# EAGLE design Sensorboard (EAGLE 9.5.2)
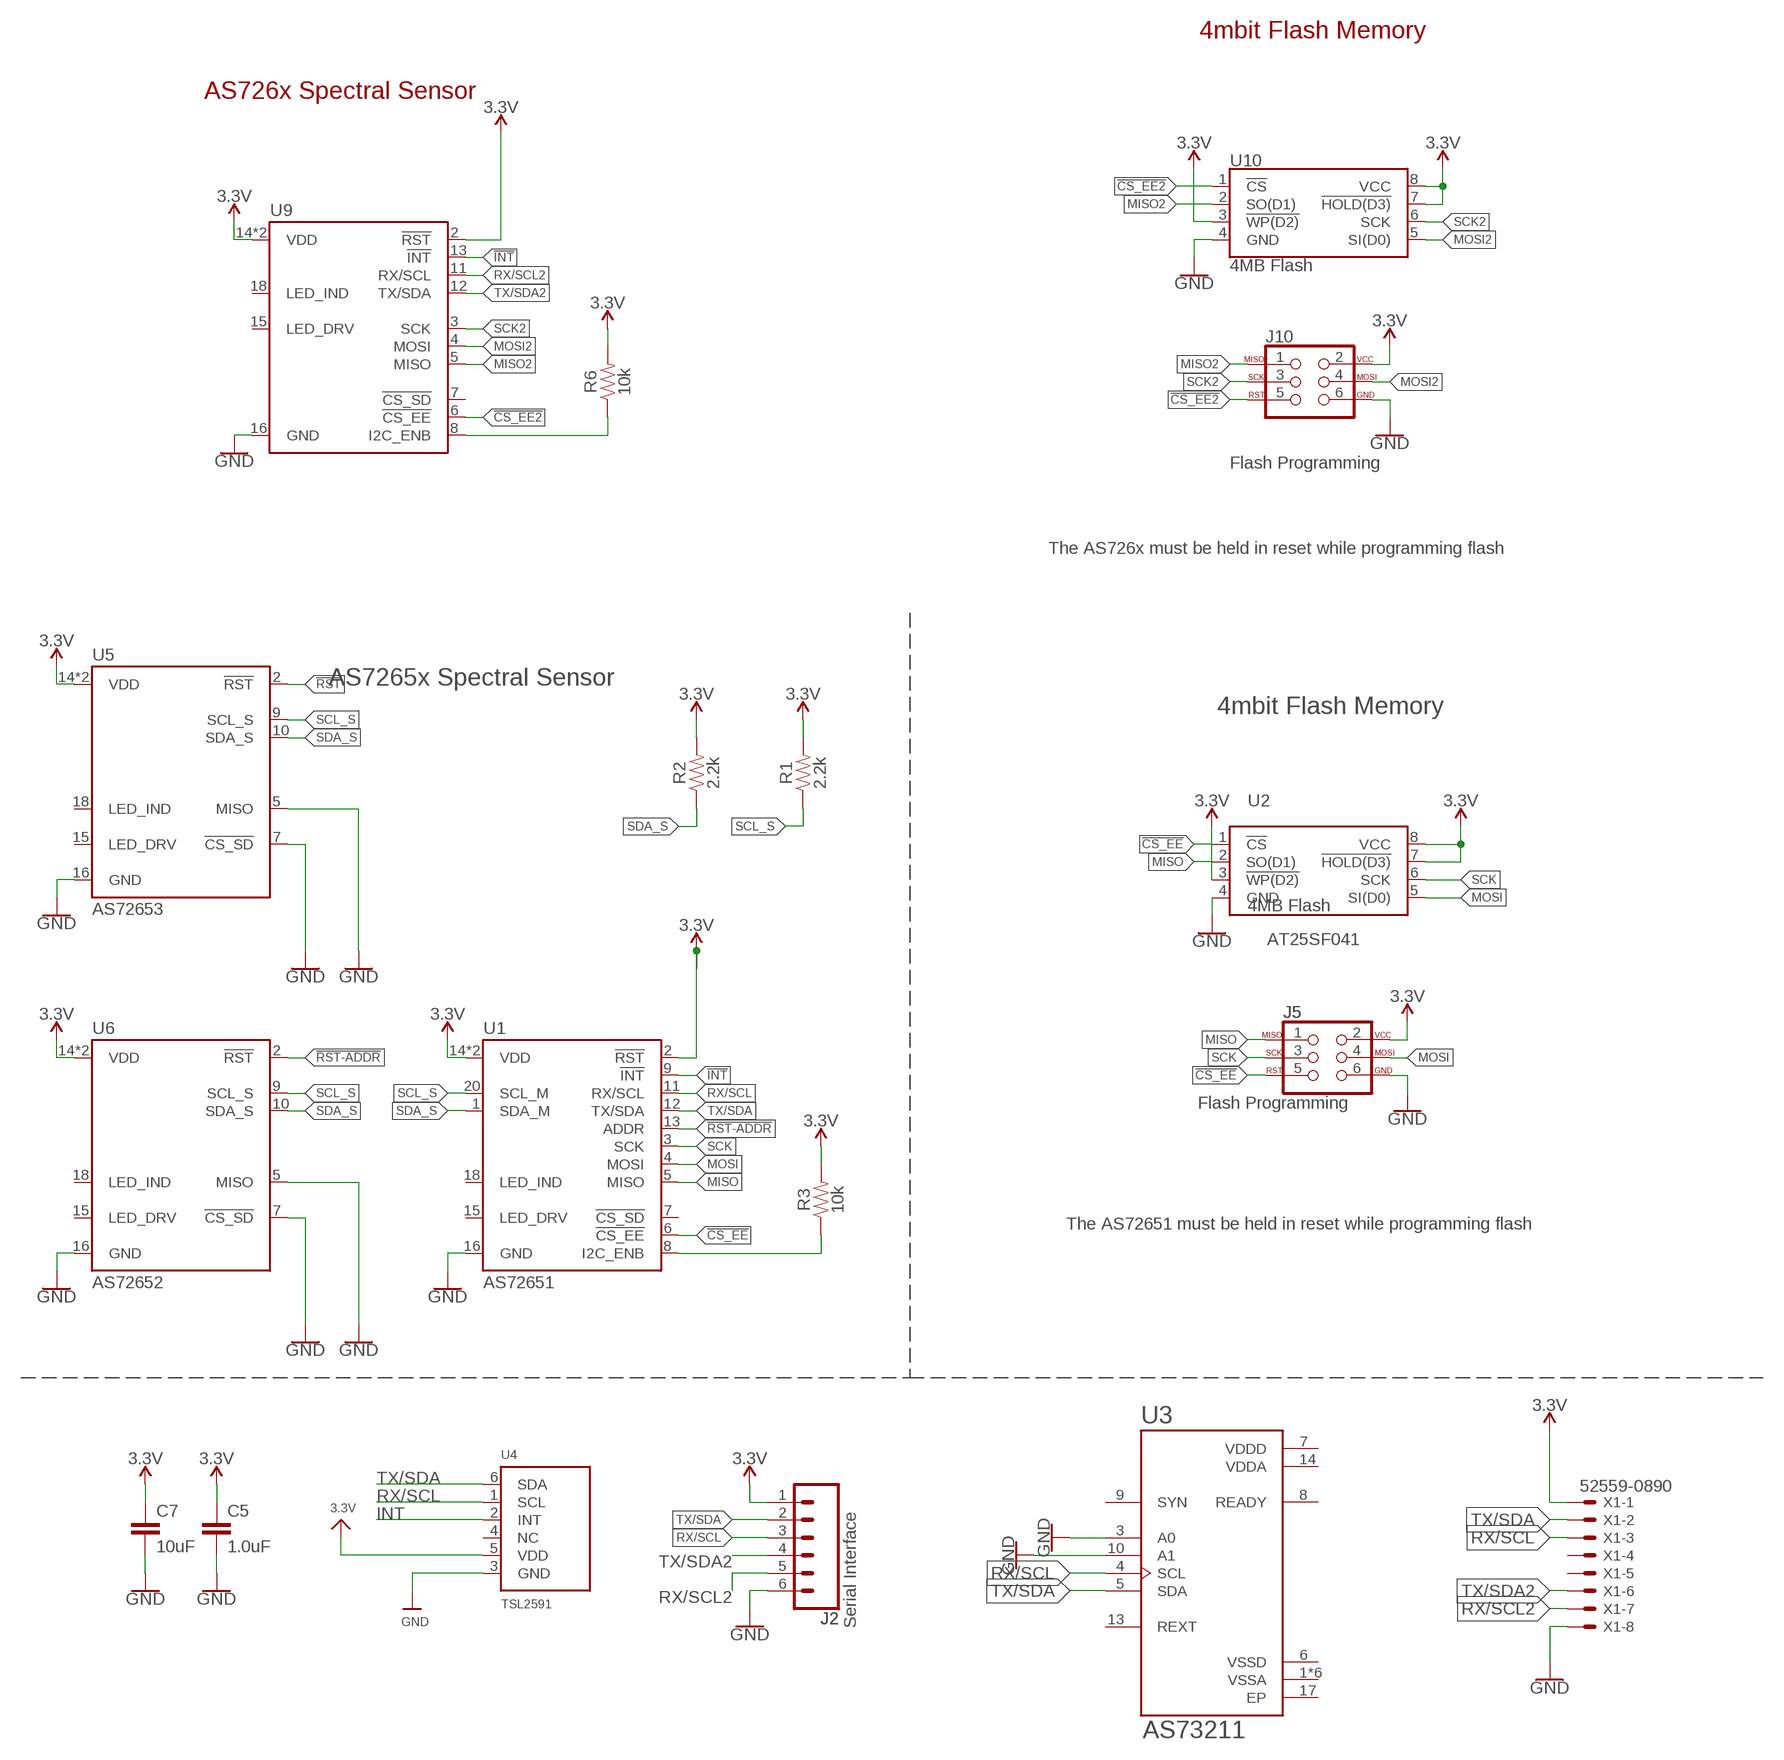
[diagram p0: schematic, sheet 1]

## Parts
C5  1.0uF  1.0UF-0603-16V-10%  [0603]
C7  10uF  10UF-0603-6.3V-20%  [0603]
J2  Serial Interface  CONN_06NO_SILK_FEMALE_PTH  [1X06_NO_SILK]
J5  Flash Programming  AVR_SPI_PROG_3X2TESTPOINTS  [2X3_TEST_POINTS]
J10  Flash Programming  AVR_SPI_PROG_3X2TESTPOINTS  [2X3_TEST_POINTS]
R1  2.2k  2.2KOHM-0603-1/10W-1%  [0603]
R2  2.2k  2.2KOHM-0603-1/10W-1%  [0603]
R3  10k  10KOHM-0603-1/10W-1%  [0603]
R6  10k  10KOHM-0603-1/10W-1%  [0603]
U1  AS72651  [LGA20]
U2  4MB Flash  AT25SF041  [SO08]
U3  AS73211  [QFN65P400X400X100-17N]
U4  TSL2591  LIGHT_TSL2591  [DFN6_TAOS]
U5  AS72653  [LGA20]
U6  AS72652  [LGA20]
U9  IR  AS726XIR  [LGA20]
U10  4MB Flash  AT25SF041  [SO08]
X1  52559-0890  [52559-0890]

## Nets
3.3V [Power]: C5.1 C7.1 J2.1 J5.2 J10.2 R1.2 R2.2 R3.2 R6.2 U1.2(!RST) U1.14(VDD) U1.17(VDD) U2.3(!WP(D2)) U2.7(!HOLD(D3)) U2.8(VCC) U4.5(VDD) U5.14(VDD) U5.17(VDD) U6.14(VDD) U6.17(VDD) U9.2(!RST) U9.14(VDD) U9.17(VDD) U10.3(!WP(D2)) U10.7(!HOLD(D3)) U10.8(VCC) X1.1
!CS_EE: J5.5 U1.6(!CS_EE) U2.1(!CS)
!CS_EE2: J10.5 U9.6(!CS_EE) U10.1(!CS)
!INT: U1.9(!INT) U9.13(!INT)
!RST: U5.2(!RST)
!RST-ADDR: U1.13(ADDR) U6.2(!RST)
GND: C5.2 C7.2 J2.6 J5.6 J10.6 U1.16(GND) U2.4(GND) U3.3(A0) U3.10(A1) U4.3(GND) U5.5(MISO) U5.7(!CS_SD) U5.16(GND) U6.5(MISO) U6.7(!CS_SD) U6.16(GND) U9.16(GND) U10.4(GND) X1.8
I2C_ENB: R3.1 U1.8(I2C_ENB)
INT: U4.2(INT)
MISO: J5.1 U1.5(MISO) U2.2(SO(D1))
MISO2: J10.1 U9.5(MISO) U10.2(SO(D1))
MOSI: J5.4 U1.4(MOSI) U2.5(SI(D0))
MOSI2: J10.4 U9.4(MOSI) U10.5(SI(D0))
N$3: R6.1 U9.8(I2C_ENB)
RX/SCL: J2.3 U1.11(RX/SCL) U3.4(SCL) U4.1(SCL) X1.3
RX/SCL2: J2.5 U9.11(RX/SCL) X1.7
SCK: J5.3 U1.3(SCK) U2.6(SCK)
SCK2: J10.3 U9.3(SCK) U10.6(SCK)
SCL_S: R1.1 U1.20(SCL_M) U5.9(SCL_S) U6.9(SCL_S)
SDA_S: R2.1 U1.1(SDA_M) U5.10(SDA_S) U6.10(SDA_S)
TX/SDA: J2.2 U1.12(TX/SDA) U3.5(SDA) U4.6(SDA) X1.2
TX/SDA2: J2.4 U9.12(TX/SDA) X1.6
Unconnected: U1.7(!CS_SD) U1.15(LED_DRV) U1.18(LED_IND) U3.8(READY) U3.9(SYN) U3.13(REXT) U4.4(NC) U5.15(LED_DRV) U5.18(LED_IND) U6.15(LED_DRV) U6.18(LED_IND) U9.7(!CS_SD) U9.15(LED_DRV) U9.18(LED_IND) X1.4 X1.5

## Notes on the sheet
- 4mbit Flash Memory
- AS726x Spectral Sensor
- The AS726x must be held in reset while programming flash
- AS7265x Spectral Sensor
- 4mbit Flash Memory
- AT25SF041
- The AS72651 must be held in reset while programming flash

## Power pins joined to a net without a drawn wire
EP: U3.17(EP)
VDDA: U3.14(VDDA)
VDDD: U3.7(VDDD)
VSSA: U3.1(VSSA) U3.2(VSSA) U3.11(VSSA) U3.12(VSSA) U3.15(VSSA) U3.16(VSSA)
VSSD: U3.6(VSSD)

## Library data of the parts
C5 = SparkFun-Capacitors:1.0UF: 1µF ceramic capacitors A capacitor is a passive two-terminal electrical component used to store electrical energy temporarily in an electric field.; PROD_ID: CAP-00868
C7 = SparkFun-Capacitors:10UF: 10.0µF ceramic capacitors A capacitor is a passive two-terminal electrical component used to store electrical energy temporarily in an electric field.; PROD_ID: CAP-11015
J2 = SparkFun-Connectors:CONN_06: Multi connection point. Often used as Generic Header-pin footprint for 0.1 inch spaced/style header connections On any of the 0.1 inch spaced packages, you can populate with these: Break Away Headers - Straight <https://www.sparkfun.com/products/116> (PRT-00116) Break Away Male Headers - Right Angle <https://www.sparkfun.com/products/553> (PRT-00553) Female Headers <https://www.sparkfun.com/products/115> (PRT-00115) Break Away Headers - Machine Pin <https://www.sparkfun.com/products/117> (PRT-00117) Break Away Female Headers - Swiss Machine Pin <https://www.sparkfun.com/products/743> (PRT-00743) Arduino Stackable Header - 6 Pin <https://www.sparkfun.com/products/9280> (PRT-09280) For SCREWTERMINALS and SPRING TERMINALS visit here: Screw Terimnals on SparkFun.com <https://www.sparkfun.com/search/results?term=Screw+Terminals> (5mm/3.5mm/2.54mm spacing) This device is also useful as a general connection point to wire up your design to another part of your project. Our various solder wires solder well into these plated through hole pads. Hook-Up Wire - Assortment (Stranded, 22 AWG) <https://www.sparkfun.com/products/11375> (PRT-11375) Hook-Up Wire - Assortment (Solid Core, 22 AWG) <https://www.sparkfun.com/products/11367> (PRT-11367) View the entire wire category on our website here <https://www.sparkfun.com/categories/141>; PROD_ID: CONN-08437
J5 J10 = SparkFun-Connectors:AVR_SPI_PROG_3X2: AVR ISP 6 Pin This is the reduced ISP connector for AVR programming. Common on Arduino. This footprint will take up less PCB space and can be used with a 10-pin to 6-pin adapter such as SKU: BOB-08508 **Special note about "TEST_POINT" package. The stop mask is on the top side, so if you want your programming test points to be on the bottom of your board, make sure to place this package on the bottom side of the board. This also ensure that the orientation to program from the bottom side will be correct. SparkFun Products: SparkFun ISP Pogo Adapter <https://www.sparkfun.com/products/11591> - NS Tiny AVR Programmer <https://www.sparkfun.com/products/11801> -PTH
R1 R2 = SparkFun-Resistors:2.2KOHM: 2.2kΩ resistor A resistor is a passive two-terminal electrical component that implements electrical resistance as a circuit element. Resistors act to reduce current flow, and, at the same time, act to lower voltage levels within circuits. - Wikipedia; PROD_ID: RES-08272
R3 R6 = SparkFun-Resistors:10KOHM: 10kΩ resistor A resistor is a passive two-terminal electrical component that implements electrical resistance as a circuit element. Resistors act to reduce current flow, and, at the same time, act to lower voltage levels within circuits. - Wikipedia; PROD_ID: RES-00824
U1 = Qwiic_Spectral_Sensor-AS7265x:AS72651; PROD_ID: IC-14127
U2 U10 = SparkFun-IC-Memory:AT25SF041: AT25SF041 4Mb Serial Flash Memory 104MHz, SPI, 8-SOIC Datasheet <http://www.adestotech.com/wp-content/uploads/DS-AT25SF041_044.pdf> SparkFun Products: SparkFun ESP8266 Thing <https://www.sparkfun.com/products/13231> SparkFun ESP8266 Thing - Dev Board <https://www.sparkfun.com/products/13711>; PROD_ID: IC-12455
U3 = AS73211:AS73211: Ambient Light Sensors AS73211-AQFT QFN16 T&RDP; AVAILABILITY: Unavailable; DESCRIPTION: AS73211 QFN16 Tradp; MF: ams; MP: AS73211; PACKAGE: QFN-16 ams; PRICE: None
U4 = microbuilder:LIGHT_TSL2591: TSL2591 Light-To-Digital Sensor
U5 = Qwiic_Spectral_Sensor-AS7265x:AS72653; PROD_ID: IC-14129
U6 = Qwiic_Spectral_Sensor-AS7265x:AS72652; PROD_ID: IC-14128
U9 = SparkFun-Sensors:AS726X; PROD_ID: IC-13731
X1 = con-molex:52559-0890: FFC/FPC-to-Board 0.50mm (.020") SMT, Vertical, ZIF Receptacle Source: http://www.molex.com/product/ffc/52559.html; MF: MOLEX; OC_FARNELL: unknown; OC_NEWARK: unknown

## Net classes
1 Power: width 0.305 mm

## Board
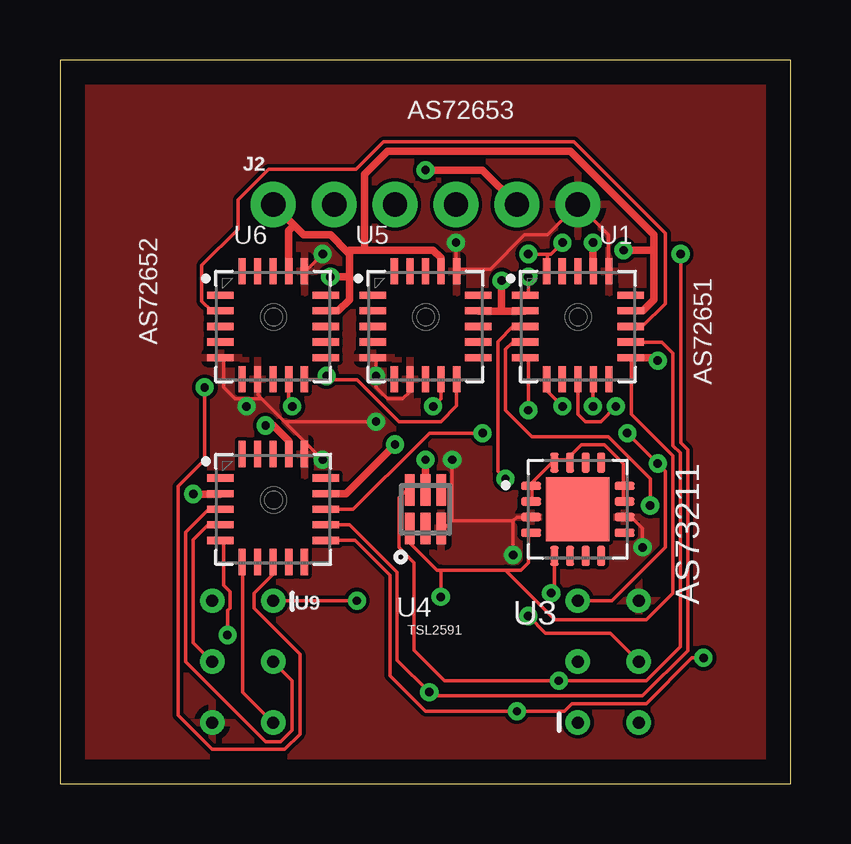
[diagram p1: board, top side]
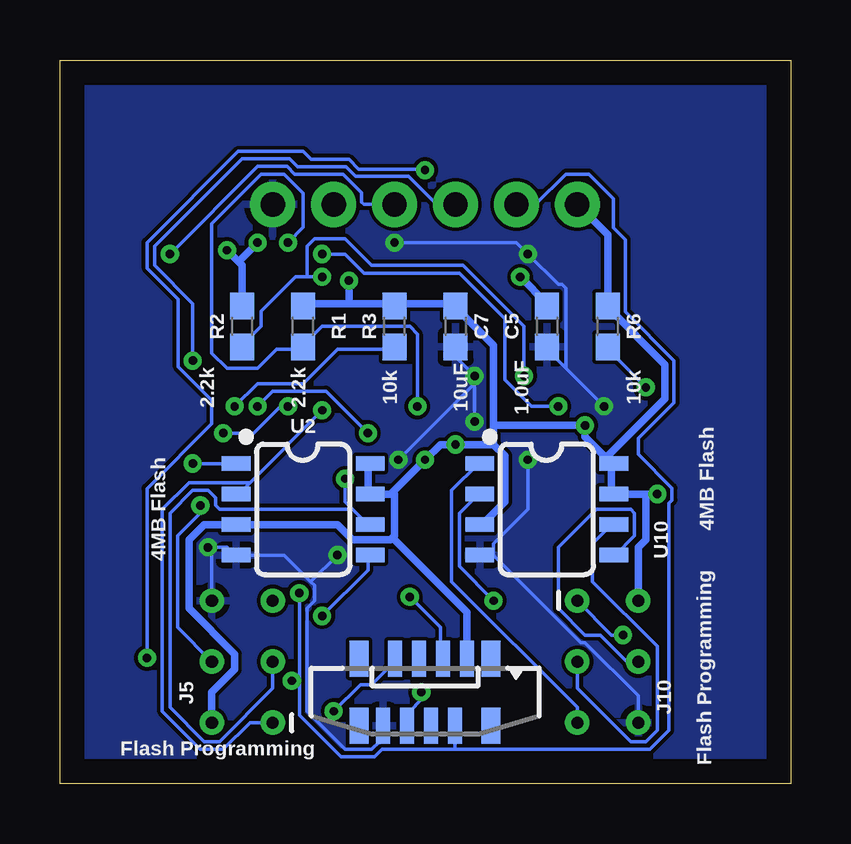
[diagram p2: board, bottom side, seen from below]

Size 30.46 x 30.15 mm. Coordinates in mm from the lower left corner, seen from the top.
Outline: 0,0 30.46,0 30.46,30.15 0,30.15 0,0
Copper layers (1*16): Top 0.035mm / dielectric 1.5mm / Bottom 0.035mm
Design rules "default": minimum track width 6mil, minimum drill 0.35mm, track to track 6mil, track to pad 6mil, pad to pad 6mil, via to via 6mil, smd to smd 6mil, copper to edge 40mil, drill to drill 6mil, minimum pad ring 10mil, minimum via ring 8mil, stop-mask expansion 4mil, vias tented up to drill 0mil, thermal gap 10mil

### Footprints (pad centres in the part's own frame; a part is rotated, then mirrored left to right if it is on the bottom)
0603 = smd 1.1 x 1: 1 -0.85,0; 2 0.85,0
1X06_NO_SILK = drill 1.016 pad 1.88: 1 0,0; 2 2.54,0; 3 5.08,0; 4 7.62,0; 5 10.16,0; 6 12.7,0
2X3_TEST_POINTS = drill 0.508: 1 -2.54,-1.27; 2 -2.54,1.27; 3 0,-1.27; 4 0,1.27; 5 2.54,-1.27; 6 2.54,1.27
LGA20 = smd 1.1 x 0.3: 1 -2.2,1.3; 2 -2.2,0.65; 3 -2.2,0; 4 -2.2,-0.65; 5 -2.2,-1.3; 11 2.2,-1.3; 12 2.2,-0.65; 13 2.2,0; 14 2.2,0.65; 15 2.2,1.3 | smd 0.3 x 1.1: 6 -1.3,-2.2; 7 -0.65,-2.2; 8 0,-2.2; 9 0.65,-2.2; 10 1.3,-2.2; 16 1.3,2.3; 17 0.65,2.3; 18 0,2.3; 19 -0.65,2.3; 20 -1.3,2.3
SO08 = smd 0.6 x 1.2: 1 -1.905,-2.8; 2 -0.635,-2.8; 3 0.635,-2.8; 4 1.905,-2.8; 5 1.905,2.8; 6 0.635,2.8; 7 -0.635,2.8; 8 -1.905,2.8
QFN65P400X400X100-17N = smd 0.84 x 0.35: 1 -1.945,0.975; 2 -1.945,0.325; 3 -1.945,-0.325; 4 -1.945,-0.975; 9 1.945,-0.975; 10 1.945,-0.325; 11 1.945,0.325; 12 1.945,0.975 | smd 0.35 x 0.84: 5 -0.975,-1.945; 6 -0.325,-1.945; 7 0.325,-1.945; 8 0.975,-1.945; 13 0.975,1.945; 14 0.325,1.945; 15 -0.325,1.945; 16 -0.975,1.945 | smd 2.65 x 2.65: 17 0,0
DFN6_TAOS = smd 1.3 x 0.4: 1 -0.8,0.65; 2 -0.8,0; 3 -0.8,-0.65; 4 0.8,-0.65; 5 0.8,0; 6 0.8,0.65
52559-0890 = smd 0.6 x 1.5: 1 -1.75,-1.4; 2 -1.25,1.4; 3 -0.75,-1.4; 4 -0.25,1.4; 5 0.25,-1.4; 6 0.75,1.4; 7 1.25,-1.4; 8 1.75,1.4 | smd 0.8 x 1.5: M1 -2.75,-1.4; M2 2.75,-1.4; M3 2.75,1.4; M4 -2.75,1.4

### Placement (x,y rotation side)
C5  10.16,19.05 270 bottom
C7  13.97,19.05 270 bottom
J2  8.89,24.13 0 top
J5  22.86,5.08 90 bottom
J10  7.62,5.08 270 bottom
R1  20.32,19.05 90 bottom
R2  22.86,19.05 90 bottom
R3  16.51,19.05 90 bottom
R6  7.62,19.05 90 bottom
U1  21.59,19.05 0 top
U2  20.32,11.43 270 bottom
U3  21.59,11.43 0 top
U4  15.24,11.43 90 top
U5  15.24,19.05 0 top
U6  8.89,19.05 0 top
U9  8.89,11.43 0 top
U10  10.16,11.43 270 bottom
X1  15.24,3.81 180 bottom

### Tracks (layer width: path | path; a pad name or v marks a point on that pad's centre or on a via)
3.3V  (via drill 0.35)
  Top 0.305: 12.06,21.11 12.06,22.07 11.99,22.15 | 12.06,21.11 12.06,20.16 11.6,19.7 U6.14 | 11.99,22.15 11.27,22.86 10.16,22.86 9.76,23.26 | J2.1 9.76,23.26 | 12.06,21.11 v11.27,21.11 | 12.7,22.23 12.06,22.23 11.99,22.15 | 12.7,22.23 15.56,22.23 15.88,21.91 15.88,21.43 U5.17 | 24.76,22.23 24.76,22.86 21.27,26.35 13.65,26.35 12.7,25.4 12.7,22.23 | 24.76,22.23 24.76,20.16 24.3,19.7 U1.14 | 24.76,22.23 v23.49,22.23 | v22.22,22.54 22.22,21.43 U1.17 | v5.56,12.06 6.67,12.06 U9.2 | v8.57,14.92 8.89,14.92 9.52,14.29 9.52,13.81 U9.17 | 18.41,19.69 19.37,19.69 U1.2 | 18.41,19.69 17.46,19.69 U5.14 | v18.41,20.96 18.41,19.69 | v15.24,13.49 U4.5 | v13.97,14.13 11.92,12.08 U9.14 | U6.17 9.54,23.03 9.76,23.26
  Bottom 0.305: J2.1 7.62,22.86 R6.2 7.62,19.84 5.24,17.46 5.24,16.03 7.7,13.57 | v11.27,21.11 10.16,20 C5.1 | R2.2 22.86,21.59 23.02,21.75 | v23.49,22.23 23.02,21.75 | 23.02,21.75 v22.22,22.54 | 6.03,12.06 U10.7 7.46,12.06 7.46,13.33 | 6.03,12.06 v5.56,12.06 | 7.46,13.33 7.7,13.57 | 7.7,13.57 8.57,14.45 v8.57,14.92 12.38,14.92 | 7.46,13.33 U10.8 | J10.2 6.35,9.84 6.03,10.16 6.03,12.06 | 16.51,20 13.97,20 C7.1 13.97,19.84 12.38,18.26 12.38,14.92 | 16.51,20 18.41,20 | 18.41,20 20.32,20 R1.2 | 16.51,20 R3.2 | 18.41,20 v18.41,20.96 | 16.59,12.14 16.67,12.06 U2.7 17.62,12.06 17.62,13.33 U2.8 | 16.59,12.14 v15.24,13.49 14.61,14.13 v13.97,14.13 12.38,14.13 | 12.38,14.13 11.91,13.65 11.91,11.75 12.86,10.79 U10.3 | 16.59,10.24 16.51,10.32 16.51,12.06 16.59,12.14 | 16.59,10.24 16.67,10.16 18.26,10.16 18.89,10.79 U2.3 24.45,10.79 25.08,10.16 25.08,7.3 23.18,5.4 23.18,4.76 24.13,3.81 J5.2 | 16.59,10.24 13.49,7.14 13.49,5.24 X1.1 | 12.38,14.13 12.38,14.92
!CS_EE  (via drill 0.35)
  Top 0.152: v20.95,15.72 20.32,16.35 20.32,16.82 U1.6 | J5.5 23.02,7.62 25.24,9.84 25.24,13.02 v24.92,13.33 v23.65,14.6
  Bottom 0.152: v20.95,15.72 21.27,15.72 22.38,14.6 v23.65,14.6 | v24.92,13.33 U2.1
!CS_EE2
  Top 0.152: J10.5 7.62,3.81 7.62,9.21 U9.6
  Bottom 0.152: J10.5 8.89,3.18 14.13,8.41 14.13,12.22 13.02,13.33 U10.1
!INT  (via drill 0.35)
  Top 0.152: U9.13 12.22,11.43 15,14.21 15.4,14.6 v17.62,14.6 | v22.22,15.72 22.22,16.83 U1.9
  Bottom 0.152: v17.62,14.6 19.37,16.35 21.59,16.35 v22.22,15.72
!RST-ADDR
  Top 0.152: U1.13 24.29,19.05 25.24,20 25.24,22.92 21.43,26.73 13.49,26.73 12.35,25.59 8.7,25.59 7.43,24.32 7.43,23.11 5.91,21.59 5.91,20.11 6.32,19.7 U6.2
GND  (via drill 0.35)
  Top 0.152: 16.35,10.95 18.89,10.95 | 16.35,10.95 16.03,10.64 U4.3 | v24.29,9.84 24.29,10.64 23.82,11.1 U3.10 | v18.89,9.53 18.89,10.95 | U5.5 13.18,17.62 v13.18,16.99 13.18,16.51 13.65,16.03 14.29,16.03 14.59,16.34 U5.7 | 10.16,14.29 9.37,15.08 | 9.37,15.08 8.41,16.03 | 8.41,16.03 8.25,16.19 8.25,16.83 U6.7 | 10.16,14.29 10.16,13.81 U9.16 | 8.41,16.03 7.78,16.03 | 7.78,16.03 7.3,16.03 6.83,16.51 6.83,17.62 U6.5 | 7.78,16.03 v7.78,15.72 | v10.95,22.07 10.32,21.43 U6.16 | 9.37,15.08 v13.18,15.08 | v16.51,22.54 16.51,21.43 U5.16 16.67,21.43 17.94,21.43 19.37,22.86 20.32,22.86 J2.6 22.86,22.86 22.86,21.38 U1.16 | 10.16,14.29 v10.95,13.49 | v16.35,13.49 16.35,10.95 | U3.3 19.04,11.1 18.89,10.95
  Bottom 0.152: 24.13,9.84 23.49,9.84 23.18,9.53 U2.4 21.11,9.53 20,8.41 | 20,8.41 19.84,8.25 19.84,7.62 20.16,7.3 20.16,3.02 18.57,1.43 17.46,1.43 17.14,1.75 17.14,2.38 X1.8 | 24.13,9.84 J5.6 | 24.13,9.84 v24.29,9.84 | 20,8.41 v18.89,9.53 | 12.38,9.53 U10.4 | 12.38,9.53 8.73,5.87 8.57,5.87 6.35,3.65 J10.6 | C7.2 13.97,17.78 v13.18,16.99 13.18,16.67 | v7.78,15.72 9.37,17.3 | 9.37,17.3 10.16,18.1 C5.2 | 9.37,17.3 9.37,20.64 9.52,20.8 9.68,20.8 v10.95,22.07 11.43,22.54 v16.51,22.54 | v13.18,15.08 13.18,16.67 | 12.38,9.53 12.38,10 10.95,11.43 v10.95,13.49 | 13.18,16.67 v16.35,13.49
  pour Bottom: 30.48,30.48 30.48,0 0,0 0,30.48
  pour Top: 0,30.48 0,0 30.48,0 30.48,30.48
I2C_ENB  (via drill 0.35)
  Top 0.152: v23.18,15.72 22.54,15.08 21.91,15.08 21.59,15.4 U1.8
  Bottom 0.152: v23.18,15.72 22.22,16.67 20.32,16.67 18.89,18.1 16.51,18.1 R3.1
MISO  (via drill 0.35)
  Top 0.152: v19.53,15.56 19.53,17.62 U1.5
  Bottom 0.152: 22.54,12.54 23.02,12.06 U2.2 | 22.54,12.54 v19.53,15.56 | J5.1 22.54,2.54 23.65,1.43 24.61,1.43 26.19,3.02 26.19,11.43 25.08,12.54 22.54,12.54
MISO2  (via drill 0.35)
  Top 0.152: U9.5 6.83,10 6.83,8.25 7.09,7.99 7.09,7.31 6.99,7.21 v6.99,6.19 | J10.1 v12.38,7.62
  Bottom 0.152: v6.99,6.19 7.46,6.19 J10.1 | v12.38,7.62 13.81,9.05 13.81,11.27 13.02,12.06 U10.2
MOSI  (via drill 0.35)
  Top 0.152: v24.61,11.59 24.61,12.7 22.86,14.45 19.68,14.45 18.57,15.56 18.57,18.1 18.88,18.4 U1.4 | v19.53,6.98 20.24,6.27 22.94,6.27 J5.4
  Bottom 0.152: v24.61,11.59 24.61,11.27 25.56,10.32 25.56,6.51 J5.4 | v19.53,6.98 17.62,8.89 17.62,9.53 U2.5
MOSI2
  Top 0.152: J10.4 5.56,5.87 5.56,10.16 6.18,10.78 U9.4
  Bottom 0.152: J10.4 6.83,5.08 7.94,6.19 8.57,6.19 9.68,7.3 9.68,9.84 8.1,11.43 6.67,11.43 6.51,11.27 6.51,10.32 7.3,9.53 U10.5
N$3  (via drill 0.35)
  Top 0.152: v6.03,16.51 6.03,13.49 4.92,12.38 4.92,2.86 6.35,1.43 9.37,1.43 10,2.06 10,5.4 8.1,7.3 8.1,7.94 8.89,8.73 U9.8
  Bottom 0.152: v6.03,16.51 7.62,18.1 R6.1
RX/SCL  (via drill 0.35)
  Top 0.152: 15.88,8.89 15.72,8.89 14.61,10 14.61,10.48 U4.1 | 15.88,8.89 18.57,8.89 | 18.57,8.89 19.21,8.89 19.53,9.21 19.53,10.32 U3.4 | 18.57,8.89 20.64,6.83 24.45,6.83 25.56,7.94 25.56,13.65 23.81,15.4 23.81,17.62 U1.11 | 15.88,8.89 v15.88,7.78
  Top 0.305: v24.92,17.62 24.79,17.75 U1.11
  Bottom 0.152: v15.88,7.78 14.61,6.51 14.61,5.24 X1.3 | J2.3 14.76,24.13 15.93,25.3 18.13,25.3 18.54,25.71 20.56,25.71 20.89,26.04 22.86,26.04 26.51,22.38 26.51,21.59 24.92,20 v24.92,17.62
RX/SCL2  (via drill 0.35)
  Top 0.152: v26.83,5.24 26.35,5.24 24.45,3.33 21.34,3.33 21.02,3.02 v19.05,3.02 15.24,3.02 13.75,4.5 13.75,8.67 12.3,10.13 U9.11
  Top 0.305: J2.5 17.62,25.56 v15.24,25.56
  Bottom 0.152: v19.05,3.02 17.94,4.13 17.46,4.13 16.51,5.08 X1.7 | v15.24,25.56 15.28,25.6 18.01,25.6 18.41,26.01 19.99,26.01 20.32,26.34 23.03,26.34 26.83,22.54 26.83,21.59 26.82,21.58 26.82,21.46 25.53,20.18 25.53,17.37 24.13,15.97 24.13,14.99 26.83,12.29 v26.83,5.24
SCK  (via drill 0.35)
  Top 0.152: U1.3 18.89,19.05 18.26,18.42 18.26,13.02 v18.57,12.7
  Bottom 0.152: v18.57,12.7 18.57,11.75 18.26,11.43 | 18.26,11.43 17.62,10.79 U2.6 | J5.3 21.59,3.97 23.81,1.75 24.45,1.75 25.88,3.18 25.88,11.27 24.92,12.22 24.29,12.22 23.97,11.91 23.97,11.59 23.81,11.43 18.26,11.43
SCK2
  Top 0.152: U9.3 6.19,11.43 5.24,10.48 5.24,5.08 8.57,1.75 9.21,1.75 9.68,2.22 9.68,4.29 J10.3
  Bottom 0.152: J10.3 8.89,3.97 6.67,1.75 6.03,1.75 5.56,2.22 5.56,5.71 8.25,8.41 8.25,10 7.46,10.79 U10.6
SCL_S  (via drill 0.35)
  Top 0.152: v15.56,15.72 15.88,16.03 15.88,16.83 U5.9 | U6.9 9.54,15.86 v9.68,15.72 | v19.53,22.07 20.32,22.07 | 20.32,22.07 20.48,22.07 v20.95,22.54 | U1.20 20.32,21.38 20.32,22.07
  Bottom 0.152: v15.56,15.72 15.56,18.73 15.88,19.05 19.53,19.05 20.32,18.26 R1.1 20.32,18.1 21.43,18.1 22.22,17.3 23.49,17.3 24.13,17.94 24.13,23.34 22.07,25.4 21.11,25.4 20.32,24.61 20.32,23.18 v20.95,22.54 | v9.68,15.72 10.79,15.72 11.91,16.83 11.91,19.37 13.81,21.27 17.78,21.27 18.57,22.07 v19.53,22.07
SDA_S  (via drill 0.35)
  Top 0.152: v19.53,21.11 19.53,20.48 U1.1 | 11.11,16.83 12.38,16.83 14.13,15.08 15.88,15.08 16.54,15.75 U5.10 | 11.11,16.83 10.32,16.83 U6.10 | 11.11,16.83 v11.11,16.99
  Bottom 0.152: 20.16,21.11 20.64,21.11 22.07,19.69 22.07,19.05 22.86,18.26 R2.1 | 20.16,21.11 v19.53,21.11 | 20.16,21.11 20.16,22.38 19.84,22.7 18.57,22.7 17.46,21.59 13.65,21.59 11.11,19.05 v11.11,16.99
TX/SDA  (via drill 0.35)
  Top 0.152: U4.6 14.45,12.22 14.13,11.91 14.13,9.84 14.76,9.21 14.76,5.56 16.03,4.29 v20.8,4.29 24.45,4.29 25.86,5.7 25.86,13.78 25.56,14.08 25.56,17.94 25.1,18.4 U1.12 | U3.5 20.61,8.07 v20.48,7.94
  Bottom 0.152: 20.48,4.29 20.48,2.86 18.73,1.11 17.35,1.11 17.03,1.43 13.97,1.43 | 20.48,4.29 v20.48,7.94 | 14.13,2.38 X1.2 | J2.2 10.64,24.13 9.37,25.4 8.41,25.4 7.38,24.37 7.38,23.16 6.89,22.67 6.89,19.65 4.86,17.62 4.86,15.88 6.35,14.38 6.35,13.72 4.95,12.32 4.95,11.81 5.08,11.68 5.08,2.22 5.87,1.43 13.97,1.43 | 20.48,4.29 v20.8,4.29 | X1.2 13.99,1.89 | X1.2 13.99,1.45 13.97,1.43
TX/SDA2  (via drill 0.35)
  Top 0.152: v25.88,22.07 25.88,14.2 26.17,13.9 26.17,5.53 24.29,3.65 15.56,3.65 v15.4,3.81 14.06,5.15 14.06,8.8 12.08,10.78 U9.12
  Bottom 0.152: v15.4,3.81 15.4,3.49 15.88,3.02 15.88,2.54 X1.6 | v25.88,22.07 22.22,25.72 21,25.72 20.68,25.4 18.67,25.4 17.88,24.61 17.88,24.23 17.78,24.13 J2.4
VSSA
  Top 0.152: U3.11 23.49,11.91 23.49,12.38 U3.12 23.49,12.54 23.49,13.33 22.7,14.13 21.75,14.13 21.11,13.49 | U3.2 19.68,11.91 19.68,12.38 U3.1 19.68,12.54 20.48,13.33 U3.16 20.64,13.49 21.11,13.49 | 21.11,13.49 U3.15